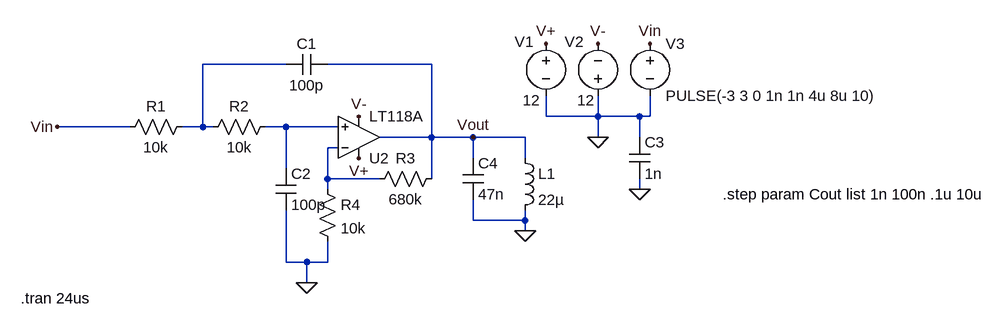
[diagram p0: schematic 2ndorderLPFchargerTx.asc]
2ndorderLPFchargerTx.asc, the LTspice schematic file:
Version 4
SHEET 1 1952 680
WIRE 0 48 -128 48
WIRE 224 48 64 48
WIRE 400 128 400 96
WIRE 480 128 480 96
WIRE 480 128 400 128
WIRE 544 128 480 128
WIRE 560 128 560 96
WIRE 560 128 544 128
WIRE -240 144 -352 144
WIRE -128 144 -128 48
WIRE -128 144 -160 144
WIRE -112 144 -128 144
WIRE 0 144 -32 144
WIRE 80 144 0 144
WIRE 224 160 224 48
WIRE 224 160 144 160
WIRE 288 160 224 160
WIRE 368 160 288 160
WIRE 480 160 480 128
WIRE 544 160 544 128
WIRE 80 176 64 176
WIRE 288 192 288 160
WIRE 368 192 368 160
WIRE 0 208 0 144
WIRE 64 224 64 176
WIRE 144 224 64 224
WIRE 224 224 224 160
WIRE 64 240 64 224
WIRE 544 240 544 224
WIRE 288 288 288 256
WIRE 368 288 368 272
WIRE 368 288 288 288
WIRE 368 304 368 288
WIRE 0 352 0 272
WIRE 32 352 0 352
WIRE 64 352 64 320
WIRE 64 352 32 352
WIRE 32 384 32 352
FLAG 480 160 0
FLAG 544 240 0
FLAG 480 16 V-
FLAG 400 16 V+
FLAG 112 192 V+
FLAG 560 16 Vin
FLAG -352 144 Vin
FLAG 288 160 Vout
FLAG 32 384 0
FLAG 112 128 V-
FLAG 368 304 0
SYMBOL res -256 160 R270
WINDOW 0 32 56 VTop 2
WINDOW 3 0 56 VBottom 2
SYMATTR InstName R1
SYMATTR Value 10k
SYMBOL res -128 160 R270
WINDOW 0 32 56 VTop 2
WINDOW 3 0 56 VBottom 2
SYMATTR InstName R2
SYMATTR Value 10k
SYMBOL res 128 240 R270
WINDOW 0 32 56 VTop 2
WINDOW 3 0 56 VBottom 2
SYMATTR InstName R3
SYMATTR Value 680k
SYMBOL res 48 224 R0
SYMATTR InstName R4
SYMATTR Value 10k
SYMBOL cap 0 64 R270
WINDOW 0 32 32 VTop 2
WINDOW 3 0 32 VBottom 2
SYMATTR InstName C1
SYMATTR Value 100p
SYMBOL cap -16 208 R0
SYMATTR InstName C2
SYMATTR Value 100p
SYMBOL voltage 400 0 R0
WINDOW 0 -48 13 Left 2
WINDOW 3 -36 103 Left 2
WINDOW 123 0 0 Left 2
WINDOW 39 0 0 Left 2
SYMATTR InstName V1
SYMATTR Value 12
SYMBOL voltage 480 112 R180
WINDOW 0 22 99 Left 2
WINDOW 3 5 9 Left 2
WINDOW 123 0 0 Left 2
WINDOW 39 0 0 Left 2
SYMATTR InstName V2
SYMATTR Value 12
SYMBOL voltage 560 0 R0
WINDOW 123 0 0 Left 2
WINDOW 39 0 0 Left 2
SYMATTR InstName V3
SYMATTR Value PULSE(-3 3 0 1n 1n 4u 8u 10)
SYMBOL cap 528 160 R0
SYMATTR InstName C3
SYMATTR Value 1n
SYMBOL Opamps\\LT118A 112 160 M180
SYMATTR InstName U2
SYMBOL ind 352 176 R0
SYMATTR InstName L1
SYMATTR Value 22µ
SYMBOL cap 272 192 R0
SYMATTR InstName C4
SYMATTR Value 47n
TEXT -408 408 Left 2 !.tran 24us
TEXT 672 248 Left 2 !.step param Cout list 1n 100n .1u 10u

The netlist it stands for:
* 2ndorderLPFchargerTx.asc
R1 Vin N001 10k
R2 N001 N002 10k
R3 N003 Vout 680k
R4 N003 0 10k
C1 N001 Vout 100p
C2 N002 0 100p
V1 V+ 0 12
V2 0 V- 12
V3 Vin 0 PULSE(-3 3 0 1n 1n 4u 8u 10)
C3 0 0 1n
* U2: LT118A (symbol Opamps\LT118A not available, pins judged from their places): In+=N002 In-=N003 V+=V+ V-=V- OUT=Vout
L1 Vout 0 22µ
C4 Vout 0 47n
.tran 24us
.step param Cout list 1n 100n .1u 10u
.backanno
.end